# EAGLE design sideboard (EAGLE 8.4.0)
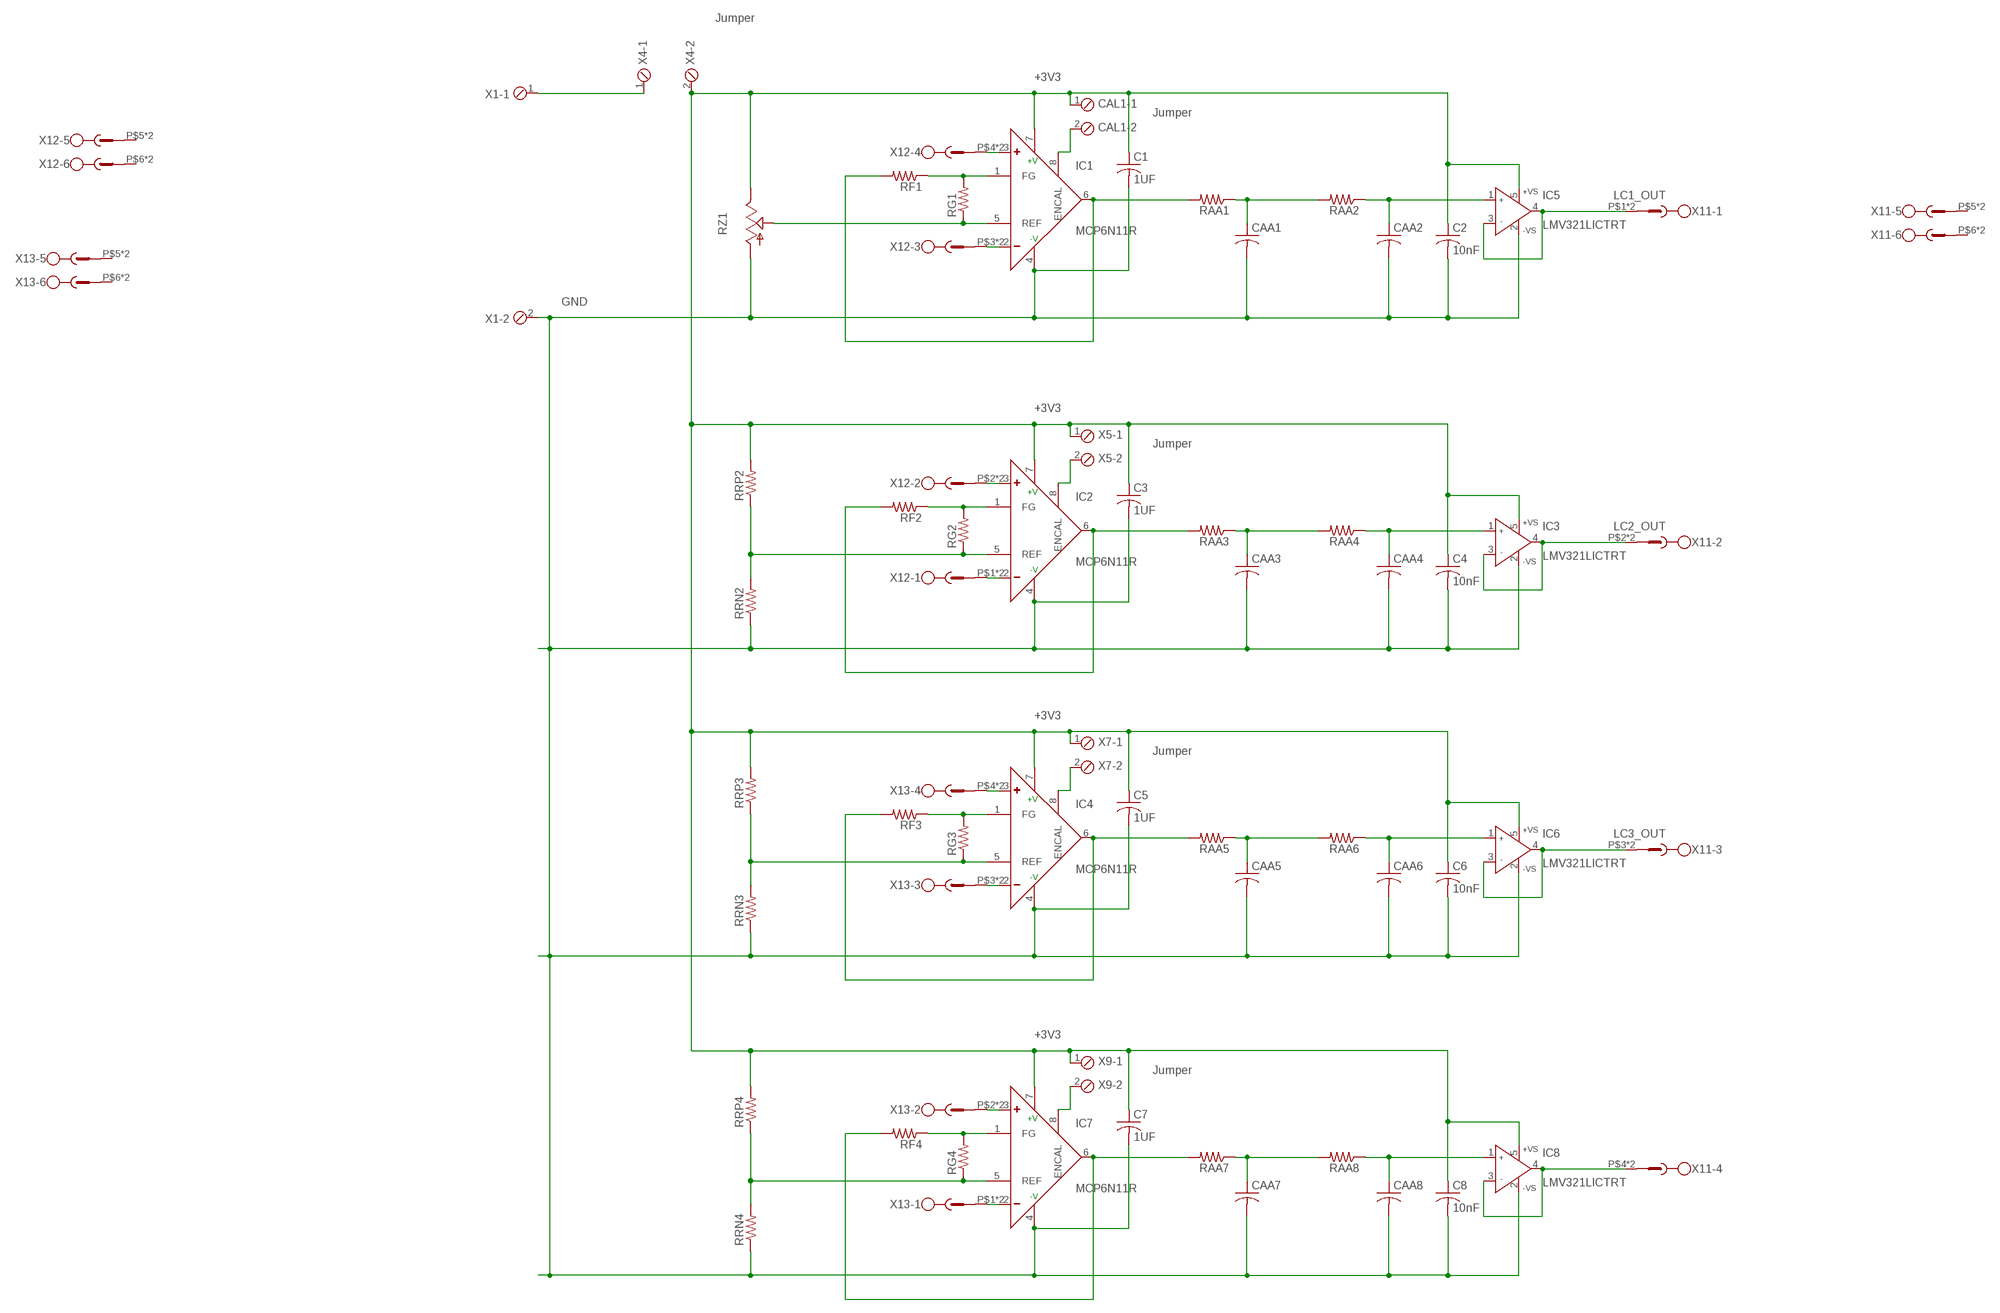
[diagram p0: schematic, sheet 1]

## Parts
C1  1UF  C-USC0603  [C0603]
C2  10nF  C-USC0603  [C0603]
C3  1UF  C-USC0603  [C0603]
C4  10nF  C-USC0603  [C0603]
C5  1UF  C-USC0603  [C0603]
C6  10nF  C-USC0603  [C0603]
C7  1UF  C-USC0603  [C0603]
C8  10nF  C-USC0603  [C0603]
CAA1  C-US025-025X050  [C025-025X050]
CAA2  C-US025-025X050  [C025-025X050]
CAA3  C-US025-025X050  [C025-025X050]
CAA4  C-US025-025X050  [C025-025X050]
CAA5  C-US025-025X050  [C025-025X050]
CAA6  C-US025-025X050  [C025-025X050]
CAA7  C-US025-025X050  [C025-025X050]
CAA8  C-US025-025X050  [C025-025X050]
CAL1  MPT2  [2POL254]
IC1  MCP6N11R  [SO-8]
IC2  MCP6N11R  [SO-8]
IC3  LMV321LICTRT  [SOT23-5]
IC4  MCP6N11R  [SO-8]
IC5  LMV321LICTRT  [SOT23-5]
IC6  LMV321LICTRT  [SOT23-5]
IC7  MCP6N11R  [SO-8]
IC8  LMV321LICTRT  [SOT23-5]
RAA1  R-US_0204/7  [0204/7]
RAA2  R-US_0204/7  [0204/7]
RAA3  R-US_0204/7  [0204/7]
RAA4  R-US_0204/7  [0204/7]
RAA5  R-US_0204/7  [0204/7]
RAA6  R-US_0204/7  [0204/7]
RAA7  R-US_0204/7  [0204/7]
RAA8  R-US_0204/7  [0204/7]
RF1  R-US_0204/7  [0204/7]
RF2  R-US_0204/7  [0204/7]
RF3  R-US_0204/7  [0204/7]
RF4  R-US_0204/7  [0204/7]
RG1  R-US_0204/7  [0204/7]
RG2  R-US_0204/7  [0204/7]
RG3  R-US_0204/7  [0204/7]
RG4  R-US_0204/7  [0204/7]
RRN2  R-US_R0805  [R0805]
RRN3  R-US_R0805  [R0805]
RRN4  R-US_R0805  [R0805]
RRP2  R-US_R0805  [R0805]
RRP3  R-US_R0805  [R0805]
RRP4  R-US_R0805  [R0805]
RZ1  TRIM_US-S64W  [S64W]
X1  MPT2  [2POL254]
X4  MPT2  [2POL254]
X5  MPT2  [2POL254]
X7  MPT2  [2POL254]
X9  MPT2  [2POL254]
X11  1770924  [1770924]
X12  1770924  [1770924]
X13  1770924  [1770924]

## Nets
+3V3: C1.1 C2.1 C3.1 C4.1 C5.1 C6.1 C7.1 C8.1 CAL1.1 IC1.7(+V) IC2.7(+V) IC3.5(+VS) IC4.7(+V) IC5.5(+VS) IC6.5(+VS) IC7.7(+V) IC8.5(+VS) RRP2.2 RRP3.2 RRP4.2 RZ1.E X4.2 X5.1 X7.1 X9.1
GND: C1.2 C2.2 C3.2 C4.2 C5.2 C6.2 C7.2 C8.2 CAA1.2 CAA2.2 CAA3.2 CAA4.2 CAA5.2 CAA6.2 CAA7.2 CAA8.2 IC1.4(-V) IC2.4(-V) IC3.2(-VS) IC4.4(-V) IC5.2(-VS) IC6.2(-VS) IC7.4(-V) IC8.2(-VS) RRN2.1 RRN3.1 RRN4.1 RZ1.A X1.2
LC1_OUT: IC5.3(IN-) IC5.4(OUT) X11.P$1 X11.P$7
LC2_OUT: IC3.3(IN-) IC3.4(OUT) X11.P$2 X11.P$8
LC3_OUT: IC6.3(IN-) IC6.4(OUT) X11.P$3 X11.P$9
LC4_OUT1: IC8.3(IN-) IC8.4(OUT) X11.P$4 X11.P$10
N$1: IC2.3(+) X12.P$2 X12.P$8
N$2: IC2.2(-) X12.P$1 X12.P$7
N$3: X1.1 X4.1
N$4: IC1.6(OUT) RAA1.2 RF1.2
N$5: CAL1.2 IC1.8(ENCAL)
N$6: CAA1.1 RAA1.1 RAA2.2
N$7: IC1.1(FG) RF1.1 RG1.2
N$8: IC1.5(REF) RG1.1 RZ1.S
N$9: CAA2.1 IC5.1(IN+) RAA2.1
N$11: IC1.2(-) X12.P$3 X12.P$9
N$12: IC1.3(+) X12.P$4 X12.P$10
N$13: IC2.8(ENCAL) X5.2
N$14: IC2.6(OUT) RAA3.2 RF2.2
N$15: IC2.1(FG) RF2.1 RG2.2
N$17: CAA3.1 RAA3.1 RAA4.2
N$18: CAA4.1 IC3.1(IN+) RAA4.1
N$19: IC2.5(REF) RG2.1 RRN2.2 RRP2.1
N$20: IC7.2(-) X13.P$1 X13.P$7
N$21: IC7.3(+) X13.P$2 X13.P$8
N$22: IC4.8(ENCAL) X7.2
N$23: IC4.6(OUT) RAA5.2 RF3.2
N$24: IC4.1(FG) RF3.1 RG3.2
N$26: CAA5.1 RAA5.1 RAA6.2
N$27: CAA6.1 IC6.1(IN+) RAA6.1
N$28: IC4.5(REF) RG3.1 RRN3.2 RRP3.1
N$29: IC4.3(+) X13.P$4 X13.P$10
N$30: IC4.2(-) X13.P$3 X13.P$9
N$31: IC7.8(ENCAL) X9.2
N$32: IC7.6(OUT) RAA7.2 RF4.2
N$33: IC7.1(FG) RF4.1 RG4.2
N$35: CAA7.1 RAA7.1 RAA8.2
N$36: CAA8.1 IC8.1(IN+) RAA8.1
N$37: IC7.5(REF) RG4.1 RRN4.2 RRP4.1
Unconnected: X11.P$5 X11.P$6 X11.P$11 X11.P$12 X12.P$5 X12.P$6 X12.P$11 X12.P$12 X13.P$5 X13.P$6 X13.P$11 X13.P$12

## Notes on the sheet
- Jumper
- Jumper
- Jumper
- Jumper
- Jumper

## Library data of the parts
C1-C8 CAA1-CAA8 = rcl:C-US: CAPACITOR, American symbol
CAL1 X1 X4 X5 X7 X9 = con-phoenix-254:MPT2: PHOENIX CONNECTOR; OC_FARNELL: unknown; OC_NEWARK: unknown
IC1 IC2 IC4 IC7 = microchip-extra:MCP6N11: Low Cost, Low Power, Instrumentation Amplifier Source: http://www.analog.com/UploadedFiles/Data_Sheets/37793330023930AD620_e.pdf; MPN: AD620AR; OC_FARNELL: 1464424; OC_NEWARK: 05F7109
IC3 IC5 IC6 IC8 = st-microelectronics-extra:LMV321LICT: High Performance, 145 MHz FastFET Op Amps Source: http://www.analog.com/static/imported-files/data_sheets/AD8065_8066.pdf; MF: ALTERA CORPORATION; MPN: AD8065ARTZ-REEL7; OC_FARNELL: 1464845; OC_NEWARK: 59K6316
RAA1-RAA8 RF1-RF4 RG1-RG4 RRN2-RRN4 RRP2-RRP4 = rcl:R-US_: RESISTOR, American symbol
RZ1 = pot:TRIM_US-: POTENTIOMETER
X11-X13 = con-phoenix-250-extra:1770924: PHOENIX; OC_FARNELL: unknown; OC_NEWARK: unknown

## Board
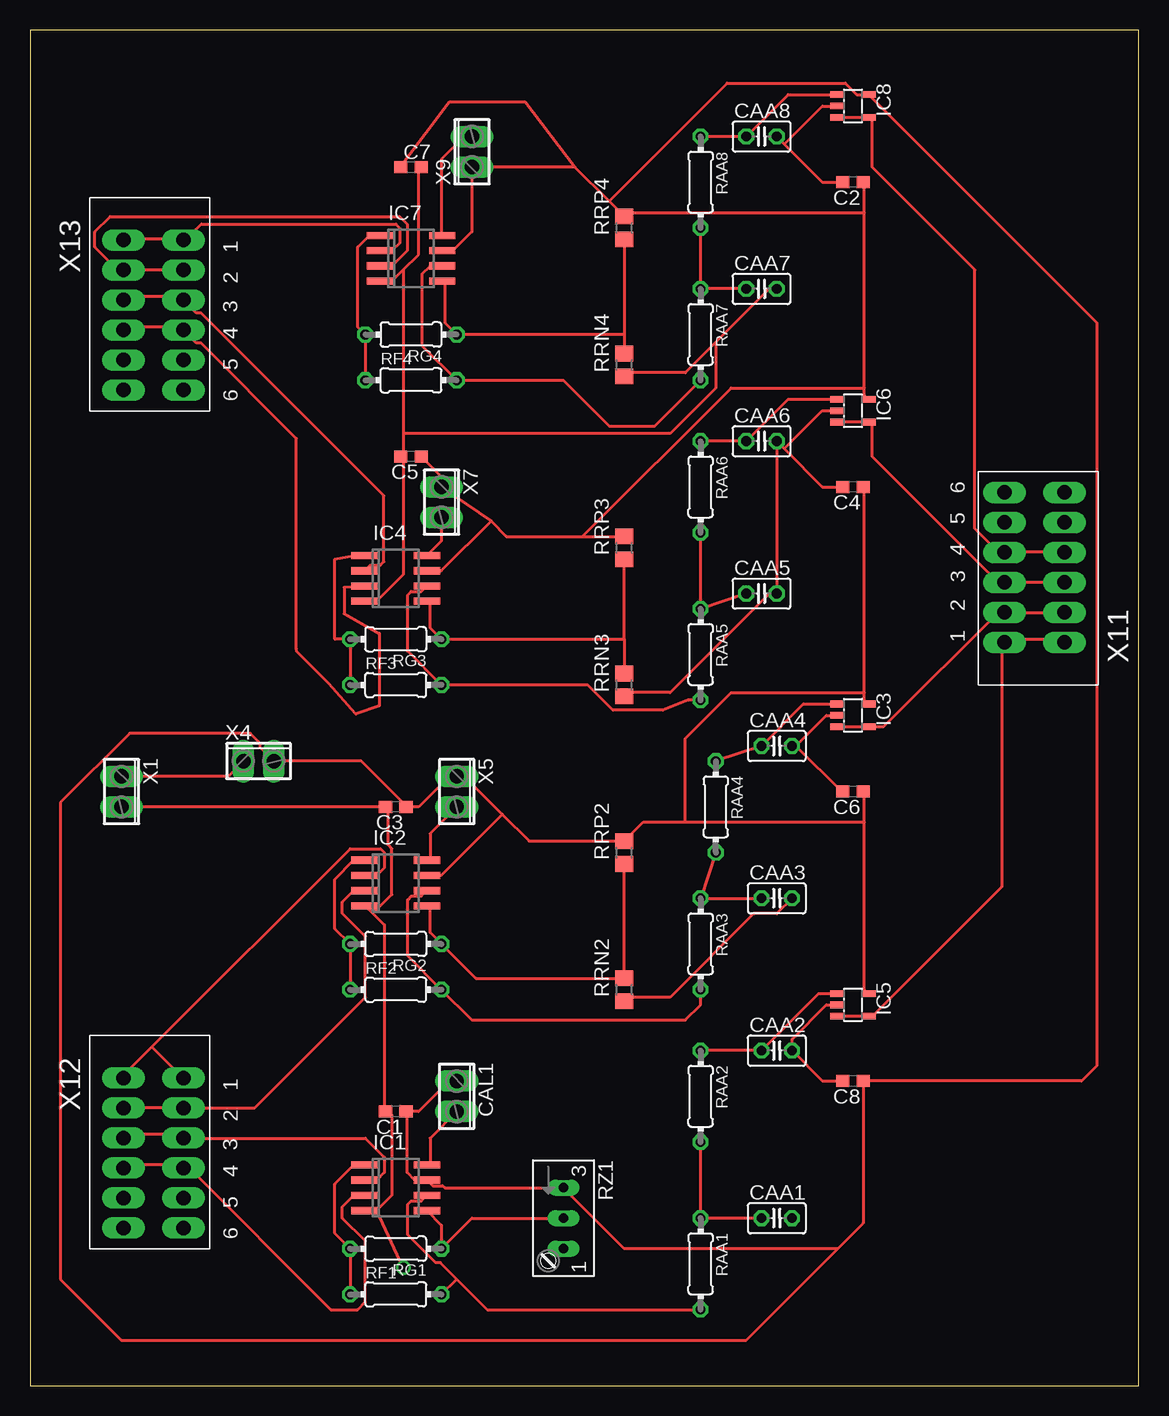
[diagram p1: board, top side]
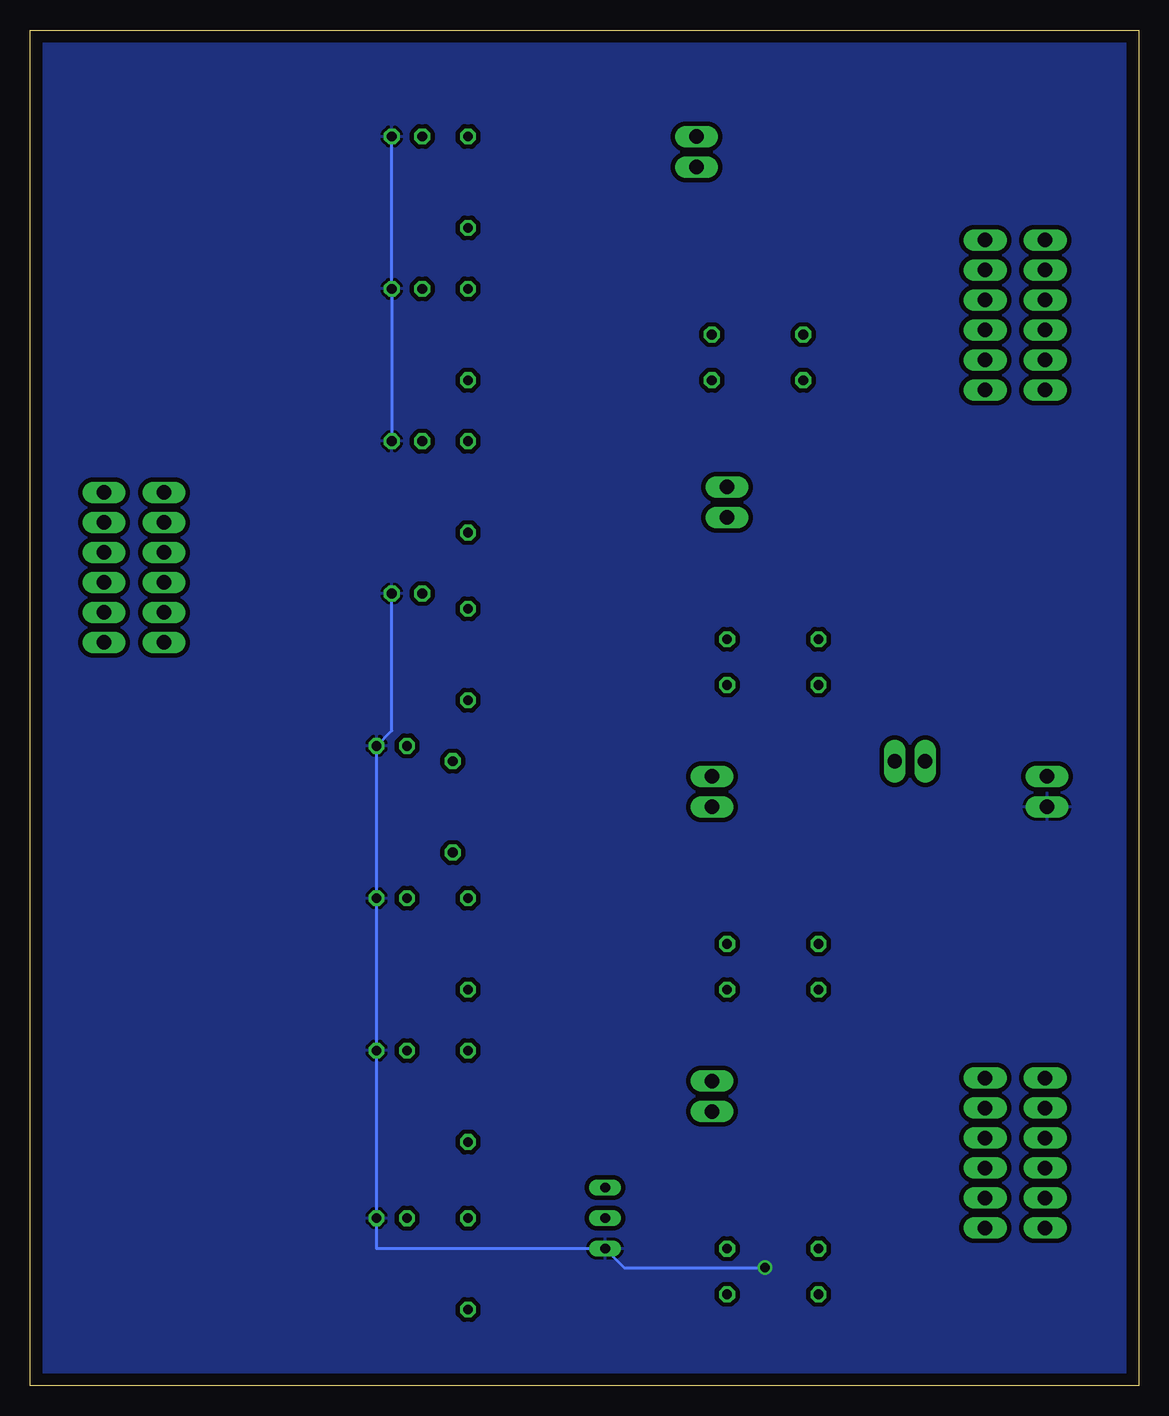
[diagram p2: board, bottom side, seen from below]

Size 92.38 x 113.02 mm. Coordinates in mm from the lower left corner, seen from the top.
Outline: 0,0 92.38,0 92.38,113.02 0,113.02 0,0
Copper layers (1*16): Top 0.035mm / dielectric 1.5mm / Bottom 0.035mm
Design rules "carvey *": minimum track width 10mil, minimum drill 0.8mm, track to track 15mil, track to pad 15mil, pad to pad 15mil, via to via 15mil, smd to smd 10mil, copper to edge 40mil, drill to drill 6mil, minimum pad ring 10mil, minimum via ring 8mil, stop-mask expansion 4mil, vias tented up to drill 0mil, thermal gap 10mil

### Footprints (pad centres in the part's own frame; a part is rotated, then mirrored left to right if it is on the bottom)
C0603 = smd 1.1 x 1: 1 -0.85,0; 2 0.85,0
C025-025X050 = drill 0.813 octagon: 1 -1.27,0; 2 1.27,0
2POL254 = drill 1.2 long: 1 -1.27,0; 2 1.27,0
SO-8 = smd 0.6 x 2.2: 1 -1.905,-2.6; 2 -0.635,-2.6; 3 0.635,-2.6; 4 1.905,-2.6; 5 1.905,2.6; 6 0.635,2.6; 7 -0.635,2.6; 8 -1.905,2.6
SOT23-5 = smd 0.55 x 1.2: 1 -0.95,-1.3; 2 0,-1.3; 3 0.95,-1.3; 4 0.95,1.3; 5 -0.95,1.3
0204/7 = drill 0.813 octagon: 1 -3.81,0; 2 3.81,0
R0805 = smd 1.3 x 1.5: 1 -0.95,0; 2 0.95,0
S64W = drill 0.813 long: A 2.54,1.27; E -2.54,1.27; S 0,1.27
1770924 = drill 1.2 long: P$1 3.55,2.7; P$2 6.05,2.7; P$3 8.55,2.7; P$4 11.05,2.7; P$5 13.55,2.7; P$6 16.05,2.7; P$7 3.55,7.7; P$8 6.05,7.7; P$9 8.55,7.7; P$10 11.05,7.7; P$11 13.55,7.7; P$12 16.05,7.7

### Placement (x,y rotation side)
C1  30.48,22.86 180 top
C2  68.58,100.33 180 top
C3  30.48,48.26 180 top
C4  68.58,74.93 180 top
C5  31.75,77.47 180 top
C6  68.58,49.53 180 top
C7  31.75,101.6 0 top
C8  68.58,25.4 180 top
CAA1  62.23,13.97 0 top
CAA2  62.23,27.94 0 top
CAA3  62.23,40.64 0 top
CAA4  62.23,53.34 0 top
CAA5  60.96,66.04 0 top
CAA6  60.96,78.74 0 top
CAA7  60.96,91.44 0 top
CAA8  60.96,104.14 0 top
CAL1  35.56,24.13 270 top
IC1  30.48,16.51 270 top
IC2  30.48,41.91 270 top
IC3  68.58,55.88 270 top
IC4  30.48,67.31 270 top
IC5  68.58,31.75 270 top
IC6  68.58,81.28 270 top
IC7  31.75,93.98 270 top
IC8  68.58,106.68 270 top
RAA1  55.88,10.16 270 top
RAA2  55.88,24.13 270 top
RAA3  55.88,36.83 270 top
RAA4  57.15,48.26 270 top
RAA5  55.88,60.96 270 top
RAA6  55.88,74.93 270 top
RAA7  55.88,87.63 270 top
RAA8  55.88,100.33 270 top
RF1  30.48,7.62 0 top
RF2  30.48,33.02 0 top
RF3  30.48,58.42 0 top
RF4  31.75,83.82 0 top
RG1  30.48,11.43 180 top
RG2  30.48,36.83 180 top
RG3  30.48,62.23 180 top
RG4  31.75,87.63 180 top
RRN2  49.53,33.02 90 top
RRN3  49.53,58.42 90 top
RRN4  49.53,85.09 90 top
RRP2  49.53,44.45 90 top
RRP3  49.53,69.85 90 top
RRP4  49.53,96.52 90 top
RZ1  43.18,13.97 270 top
X1  7.62,49.53 270 top
X4  19.05,52.07 0 top
X5  35.56,49.53 270 top
X7  34.29,73.66 270 top
X9  36.83,102.87 90 top
X11  88.9,58.42 90 top
X12  5.08,29.21 270 top
X13  5.08,99.06 270 top

### Tracks (layer width: path | path; a pad name or v marks a point on that pad's centre or on a via)
+3V3
  Top 0.254: 69.53,83.19 69.53,82.55 69.85,82.23 IC6.5 | 69.53,83.19 69.53,97.79 | 69.53,97.79 69.53,100.33 C2.1 | IC7.7 35.24,94.61 36.83,96.2 X9.1 45.4,101.6 | 49.21,97.79 RRP4.2 49.21,97.79 | 49.21,97.79 48.26,98.74 | 48.26,98.74 45.4,101.6 | 45.4,101.6 41.27,107 34.92,107 31.11,101.92 31.11,101.6 C7.1 | 48.26,98.74 58.1,108.58 67.94,108.58 68.9,107.63 69.85,107.63 IC8.5 88.9,88.61 88.9,26.67 87.63,25.4 C8.1 69.43,13.55 67.31,11.43 | 49.21,97.79 69.53,97.79 | 31.43,22.86 32.38,22.86 34.92,25.4 CAL1.1 | 31.43,22.86 31.43,17.78 32.07,17.14 IC1.7 33.54,16.68 34.39,16.68 34.56,16.51 RZ1.E 49.53,11.43 67.31,11.43 | 31.43,22.86 C1.1 | 46.04,70.8 39.69,70.8 38.42,72.07 | 46.04,70.8 RRP3.2 | 38.42,72.07 X7.1 34.29,75.78 C5.1 | IC4.7 34.29,67.94 38.42,72.07 | 69.53,57.78 69.53,57.15 69.85,56.83 IC3.5 | 69.53,57.78 69.53,74.93 C4.1 | 69.53,46.99 69.53,33.02 69.85,32.7 IC5.5 | 69.53,46.99 69.53,49.53 C6.1 | 31.43,48.26 32.38,48.26 34.92,50.8 X5.1 36.2,50.8 39.37,47.62 | RRP2.2 41.59,45.4 39.37,47.62 | IC2.7 34.29,42.55 39.37,47.62 | 31.43,48.26 27.62,52.07 X4.2 19.19,53.2 19.19,53.55 18.36,54.38 8.31,54.38 2.54,48.61 2.54,8.89 7.62,3.81 59.69,3.81 67.31,11.43 | 31.43,48.26 C3.1 | 54.61,46.99 51.12,46.99 RRP2.2 | 54.61,46.99 69.53,46.99 | RRP2.2 | 69.53,57.78 58.42,57.78 54.61,53.98 54.61,46.99 | 69.53,83.19 58.42,83.19 46.04,70.8
GND  (via drill 0.8)
  Top 0.254: IC4.4 28.89,65.41 31.11,67.63 31.11,77.47 | 31.11,93.03 30.16,92.08 IC7.4 | 31.11,93.03 32.38,94.3 32.38,101.6 C7.2 | 31.11,93.03 31.11,79.38 | 31.11,79.38 31.11,77.47 | RRN3.1 49.53,57.78 53.34,57.78 61.59,66.04 CAA5.2 CAA6.2 62.87,78.11 | C2.2 66.04,100.33 62.87,103.5 | CAA8.2 62.87,103.5 | IC8.2 66.04,106.68 62.87,103.5 | C4.2 66.04,74.93 62.87,78.11 | IC6.2 66.04,81.28 62.87,78.11 | 57.15,87 61.59,91.44 CAA7.2 | 57.15,87 54.61,84.45 49.53,84.45 RRN4.1 | 28.57,39.37 27.94,40.01 IC2.4 | 28.57,39.37 29.53,38.42 29.53,22.86 C1.2 29.84,22.86 30.16,22.54 30.16,15.88 28.89,14.61 | 28.57,39.37 30.16,40.96 30.16,44.77 29.84,45.09 29.84,48.26 C3.2 X1.2 | 28.89,14.61 IC1.4 27.94,14.61 | 63.82,53.34 67.63,49.53 C6.2 | IC3.2 66.36,55.88 63.82,53.34 | 63.82,53.34 CAA4.2 | C8.2 66.04,25.4 CAA2.2 63.5,28.89 66.36,31.75 IC5.2 | CAA3.2 62.23,39.37 60.33,39.37 53.34,32.38 49.53,32.38 RRN2.1 | v31.11,9.84 28.89,14.61 | C5.2 31.11,77.47 | 31.11,79.38 53.34,79.38 57.15,83.19 57.15,87
  Bottom 0.254: CAA6.2 CAA7.2 CAA8.2 | v31.11,9.84 42.86,9.84 RZ1.A 63.5,11.43 CAA1.2 CAA2.2 CAA3.2 CAA4.2 62.23,54.61 CAA5.2
  pour Bottom: 0,0 0,113.03 91.44,113.03 92.71,113.03 92.71,0
LC1_OUT
  Top 0.254: IC5.3 67.31,30.8 69.85,30.8 IC5.4 70.17,30.8 80.96,41.59 80.96,61.91 X11.P$7 81.28,62.23 86.04,62.23 X11.P$1
LC2_OUT
  Top 0.254: IC3.3 67.31,54.93 69.85,54.93 IC3.4 70.17,54.93 71.12,54.93 80.96,64.77 X11.P$8 81.28,64.45 86.04,64.45 X11.P$2
LC3_OUT
  Top 0.254: IC6.3 67.31,80.33 69.85,80.33 IC6.4 70.17,80.33 70.17,77.47 80.96,66.67 X11.P$9 81.28,66.99 86.04,66.99 X11.P$3
LC4_OUT1
  Top 0.254: IC8.3 67.31,105.73 69.85,105.73 IC8.4 70.17,105.73 70.17,101.6 78.74,93.03 78.74,71.44 80.96,69.22 X11.P$10 81.28,69.53 86.04,69.53 X11.P$4
N$1
  Top 0.254: IC2.3 26.99,41.27 26.04,40.32 26.04,39.37 27.94,37.47 27.94,32.38 18.73,23.18 13.02,23.18 X12.P$8 12.7,23.18 7.94,23.18 X12.P$2
N$2
  Top 0.254: IC2.2 28.89,42.55 29.53,43.18 29.53,44.45 29.21,44.77 26.67,44.77 10.16,28.26 | 10.16,28.26 7.62,25.72 X12.P$1 | 10.16,28.26 12.7,25.72 X12.P$7
N$3
  Top 0.254: X1.1 16.51,50.8 X4.1
N$4
  Top 0.254: 33.97,15.88 IC1.6 32.62,15.41 31.77,15.41 31.47,15.12 31.47,12.6 33.81,10.26 34.19,10.26 35.56,8.89 | RF1.2 35.56,8.89 | RAA1.2 38.1,6.35 35.56,8.89
N$5
  Top 0.254: CAL1.2 33.34,20.64 33.34,18.41 IC1.8
N$6
  Top 0.254: CAA1.1 RAA1.1 RAA2.2
N$7
  Top 0.254: IC1.1 26.99,18.41 25.4,16.83 25.4,12.7 RG1.2 RF1.1
N$8
  Top 0.254: IC1.5 34.29,13.39 RG1.1 36.83,13.97 RZ1.S
N$9
  Top 0.254: IC5.1 66.99,32.7 65.72,32.7 CAA2.1 RAA2.1
N$11
  Top 0.254: IC1.2 28.89,17.14 29.53,17.78 29.53,19.05 27.94,20.64 13.02,20.64 X12.P$9 12.7,20.95 7.94,20.95 X12.P$3
N$12
  Top 0.254: IC1.3 26.99,15.88 26.04,14.92 26.04,13.97 27.94,12.06 27.94,6.99 27.3,6.35 25.08,6.35 13.02,18.41 X12.P$10 12.7,18.41 7.94,18.41 X12.P$4
N$13
  Top 0.254: X5.2 33.34,46.04 33.34,43.81 IC2.8
N$14
  Top 0.254: 33.97,41.27 IC2.6 32.62,40.81 31.77,40.81 31.47,40.52 31.47,35.84 RF2.2 36.83,30.48 54.61,30.48 55.88,31.75 RAA3.2
N$15
  Top 0.254: IC2.1 26.99,43.81 25.4,42.23 25.4,38.1 RG2.2 RF2.1
N$17
  Top 0.254: RAA4.2 RAA3.1 CAA3.1
N$18
  Top 0.254: IC3.1 66.99,56.83 64.45,56.83 CAA4.1 RAA4.1
N$19
  Top 0.254: IC2.5 33.34,40.01 33.34,37.78 RG2.1 37.15,33.97 RRN2.2 RRP2.1
N$20
  Top 0.254: IC7.2 30.16,94.61 30.8,95.25 30.8,96.52 30.48,96.84 14.29,96.84 13.02,95.57 X13.P$7 12.7,95.57 7.94,95.57 X13.P$1
N$21
  Top 0.254: IC7.3 30.16,93.34 31.43,94.61 31.43,96.84 30.8,97.47 6.67,97.47 5.4,96.2 5.4,94.93 7.62,92.71 X13.P$2 7.94,93.03 12.7,93.03 X13.P$8
N$22
  Top 0.254: X7.2 34.29,70.42 IC4.8
N$23
  Top 0.254: 33.97,66.67 IC4.6 32.62,66.21 31.77,66.21 31.47,65.92 31.47,61.24 RF3.2 46.46,58.42 48.57,56.31 52.77,56.31 54.87,57.15 RAA5.2
N$24
  Top 0.254: IC4.1 26.99,69.22 25.4,68.9 25.4,62.23 RG3.2 RF3.1
N$26
  Top 0.254: CAA5.1 RAA5.1 RAA6.2
N$27
  Top 0.254: IC6.1 66.99,82.23 63.18,82.23 CAA6.1 RAA6.1
N$28
  Top 0.254: IC4.5 33.34,65.41 33.34,63.18 RG3.1 49.53,62.23 | 49.53,62.23 RRP3.1 | 49.53,62.23 RRN3.2
N$29
  Top 0.254: X13.P$4 7.94,88.27 12.7,88.27 X13.P$10 13.87,86.92 14.26,86.92 22.21,78.97 22.21,61.45 22.23,61.21 24.92,58.52 27.15,55.98 29.11,56.67 29.11,62.71 26.19,64.37 26.19,66.55 IC4.3
N$30
  Top 0.254: X13.P$3 7.94,90.81 12.7,90.81 X13.P$9 13.87,89.42 14.26,89.42 29.49,74.19 29.49,68.7 29.19,68.41 28.34,68.41 IC4.2
N$31
  Top 0.254: X9.2 36.2,104.14 34.29,102.23 34.29,95.89 IC7.8
N$32
  Top 0.254: IC7.6 33.34,93.34 32.7,92.71 32.7,86.68 RF4.2 44.45,83.82 48.26,80.01 52.07,80.01 RAA7.2
N$33
  Top 0.254: IC7.1 28.26,95.89 27.3,94.93 27.3,88.27 RG4.2 RF4.1
N$35
  Top 0.254: CAA7.1 RAA7.1 RAA8.2
N$36
  Top 0.254: IC8.1 66.99,107.63 63.18,107.63 CAA8.1 RAA8.1
N$37
  Top 0.254: IC7.5 34.61,92.08 34.61,88.58 RG4.1 49.53,87.63 | RRP4.1 49.53,87.63 | 49.53,87.63 RRN4.2